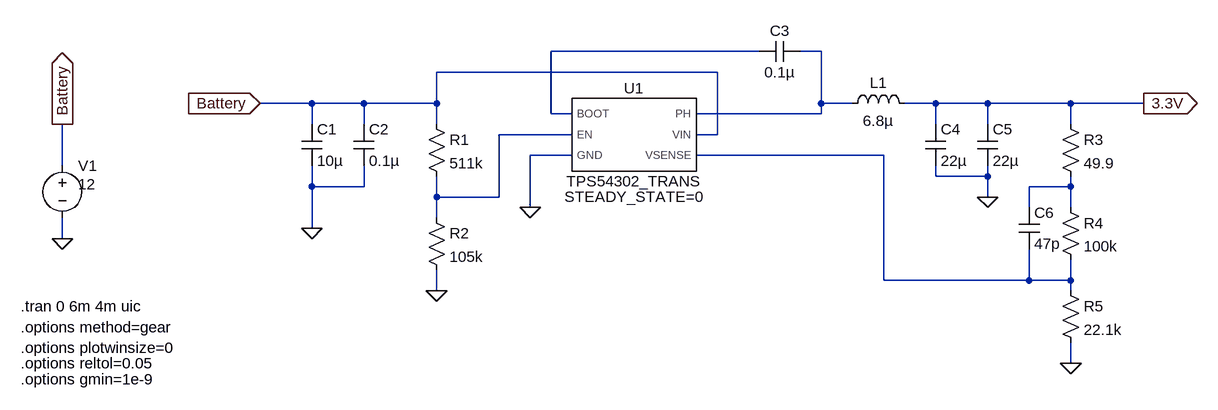
[diagram p0: schematic Caravan-monitor.asc]
Caravan-monitor.asc, the LTspice schematic file:
Version 4.1
SHEET 1 1600 680
WIRE 896 -192 576 -192
WIRE 992 -192 960 -192
WIRE 832 -160 400 -160
WIRE 208 -112 128 -112
WIRE 288 -112 208 -112
WIRE 400 -112 400 -160
WIRE 400 -112 288 -112
WIRE 992 -112 992 -192
WIRE 1040 -112 992 -112
WIRE 1168 -112 1120 -112
WIRE 1248 -112 1168 -112
WIRE 1376 -112 1248 -112
WIRE 1488 -112 1376 -112
WIRE 576 -96 576 -192
WIRE 608 -96 576 -96
WIRE 992 -96 992 -112
WIRE 992 -96 800 -96
WIRE 208 -80 208 -112
WIRE 288 -80 288 -112
WIRE 400 -80 400 -112
WIRE 1168 -80 1168 -112
WIRE 1248 -80 1248 -112
WIRE 1376 -80 1376 -112
WIRE 608 -64 496 -64
WIRE 832 -64 832 -160
WIRE 832 -64 800 -64
WIRE 608 -32 544 -32
WIRE 1088 -32 800 -32
WIRE -176 -16 -176 -80
WIRE 1168 0 1168 -16
WIRE 1248 0 1248 -16
WIRE 1248 0 1168 0
WIRE 208 16 208 -16
WIRE 288 16 288 -16
WIRE 288 16 208 16
WIRE 1376 16 1376 0
WIRE 1376 16 1312 16
WIRE 400 32 400 0
WIRE 496 32 496 -64
WIRE 496 32 400 32
WIRE 1248 32 1248 0
WIRE 544 48 544 -32
WIRE 1312 48 1312 16
WIRE 1376 48 1376 16
WIRE 400 64 400 32
WIRE 208 80 208 16
WIRE -176 96 -176 64
WIRE 1088 160 1088 -32
WIRE 1312 160 1312 112
WIRE 1312 160 1088 160
WIRE 1376 160 1376 128
WIRE 1376 160 1312 160
WIRE 400 176 400 144
WIRE 1376 176 1376 160
WIRE 1376 288 1376 256
FLAG -176 96 0
FLAG -176 -80 Battery
IOPIN -176 -80 Out
FLAG 208 80 0
FLAG 128 -112 Battery
IOPIN 128 -112 In
FLAG 400 176 0
FLAG 544 48 0
FLAG 1248 32 0
FLAG 1376 288 0
FLAG 1488 -112 3.3V
IOPIN 1488 -112 Out
SYMBOL cap 192 -80 R0
SYMATTR InstName C1
SYMATTR Value 10µ
SYMBOL cap 272 -80 R0
SYMATTR InstName C2
SYMATTR Value 0.1µ
SYMBOL res 384 -96 R0
SYMATTR InstName R1
SYMATTR Value 511k
SYMBOL TPS54302_TRANS 704 -64 R0
SYMATTR InstName U1
SYMBOL res 384 48 R0
SYMATTR InstName R2
SYMATTR Value 105k
SYMBOL cap 960 -208 R90
WINDOW 0 0 32 VBottom 2
WINDOW 3 32 32 VTop 2
SYMATTR InstName C3
SYMATTR Value 0.1µ
SYMBOL ind 1024 -96 R270
WINDOW 0 32 56 VTop 2
WINDOW 3 5 56 VBottom 2
SYMATTR InstName L1
SYMATTR Value 6.8µ
SYMBOL cap 1152 -80 R0
SYMATTR InstName C4
SYMATTR Value 22µ
SYMBOL cap 1232 -80 R0
SYMATTR InstName C5
SYMATTR Value 22µ
SYMBOL res 1360 -96 R0
SYMATTR InstName R3
SYMATTR Value 49.9
SYMBOL res 1360 32 R0
SYMATTR InstName R4
SYMATTR Value 100k
SYMBOL cap 1296 48 R0
SYMATTR InstName C6
SYMATTR Value 47p
SYMBOL res 1360 160 R0
SYMATTR InstName R5
SYMATTR Value 22.1k
SYMBOL voltage -176 -32 R0
WINDOW 3 24 44 Left 2
WINDOW 123 0 0 Left 0
WINDOW 39 0 0 Left 0
SYMATTR Value 12
SYMATTR InstName V1
TEXT -240 200 Left 2 !.tran 0 6m 4m uic
TEXT -240 232 Left 2 !.options method=gear
TEXT -240 264 Left 2 !.options plotwinsize=0
TEXT -240 288 Left 2 !.options reltol=0.05
TEXT -240 312 Left 2 !.options gmin=1e-9

The netlist it stands for:
* Caravan-monitor.asc
C1 Battery 0 10µ
C2 Battery 0 0.1µ
R1 Battery N003 511k
X§U1 N001 N003 0 N002 Battery N004 TPS54302_TRANS STEADY_STATE=0  ; pins BOOT EN GND PH VIN VSENSE
R2 N003 0 105k
C3 N002 N001 0.1µ
L1 N002 3.3V 6.8µ
C4 3.3V 0 22µ
C5 3.3V 0 22µ
R3 3.3V N005 49.9
R4 N005 N004 100k
C6 N005 N004 47p
R5 N004 0 22.1k
V1 Battery 0 12
.tran 0 6m 4m uic
.options method=gear
.options plotwinsize=0
.options reltol=0.05
.options gmin=1e-9
.lib D:\home\mikko\Git\Caravan-Monitor\LTSpice\TPS54202_PSPICE_TRANS\TPS54302_PSPICE_TRANS\TPS54302_TRANS.LIB
.backanno
.end